# EAGLE design amiga-usb-disk-reader (EAGLE 9.3.0)
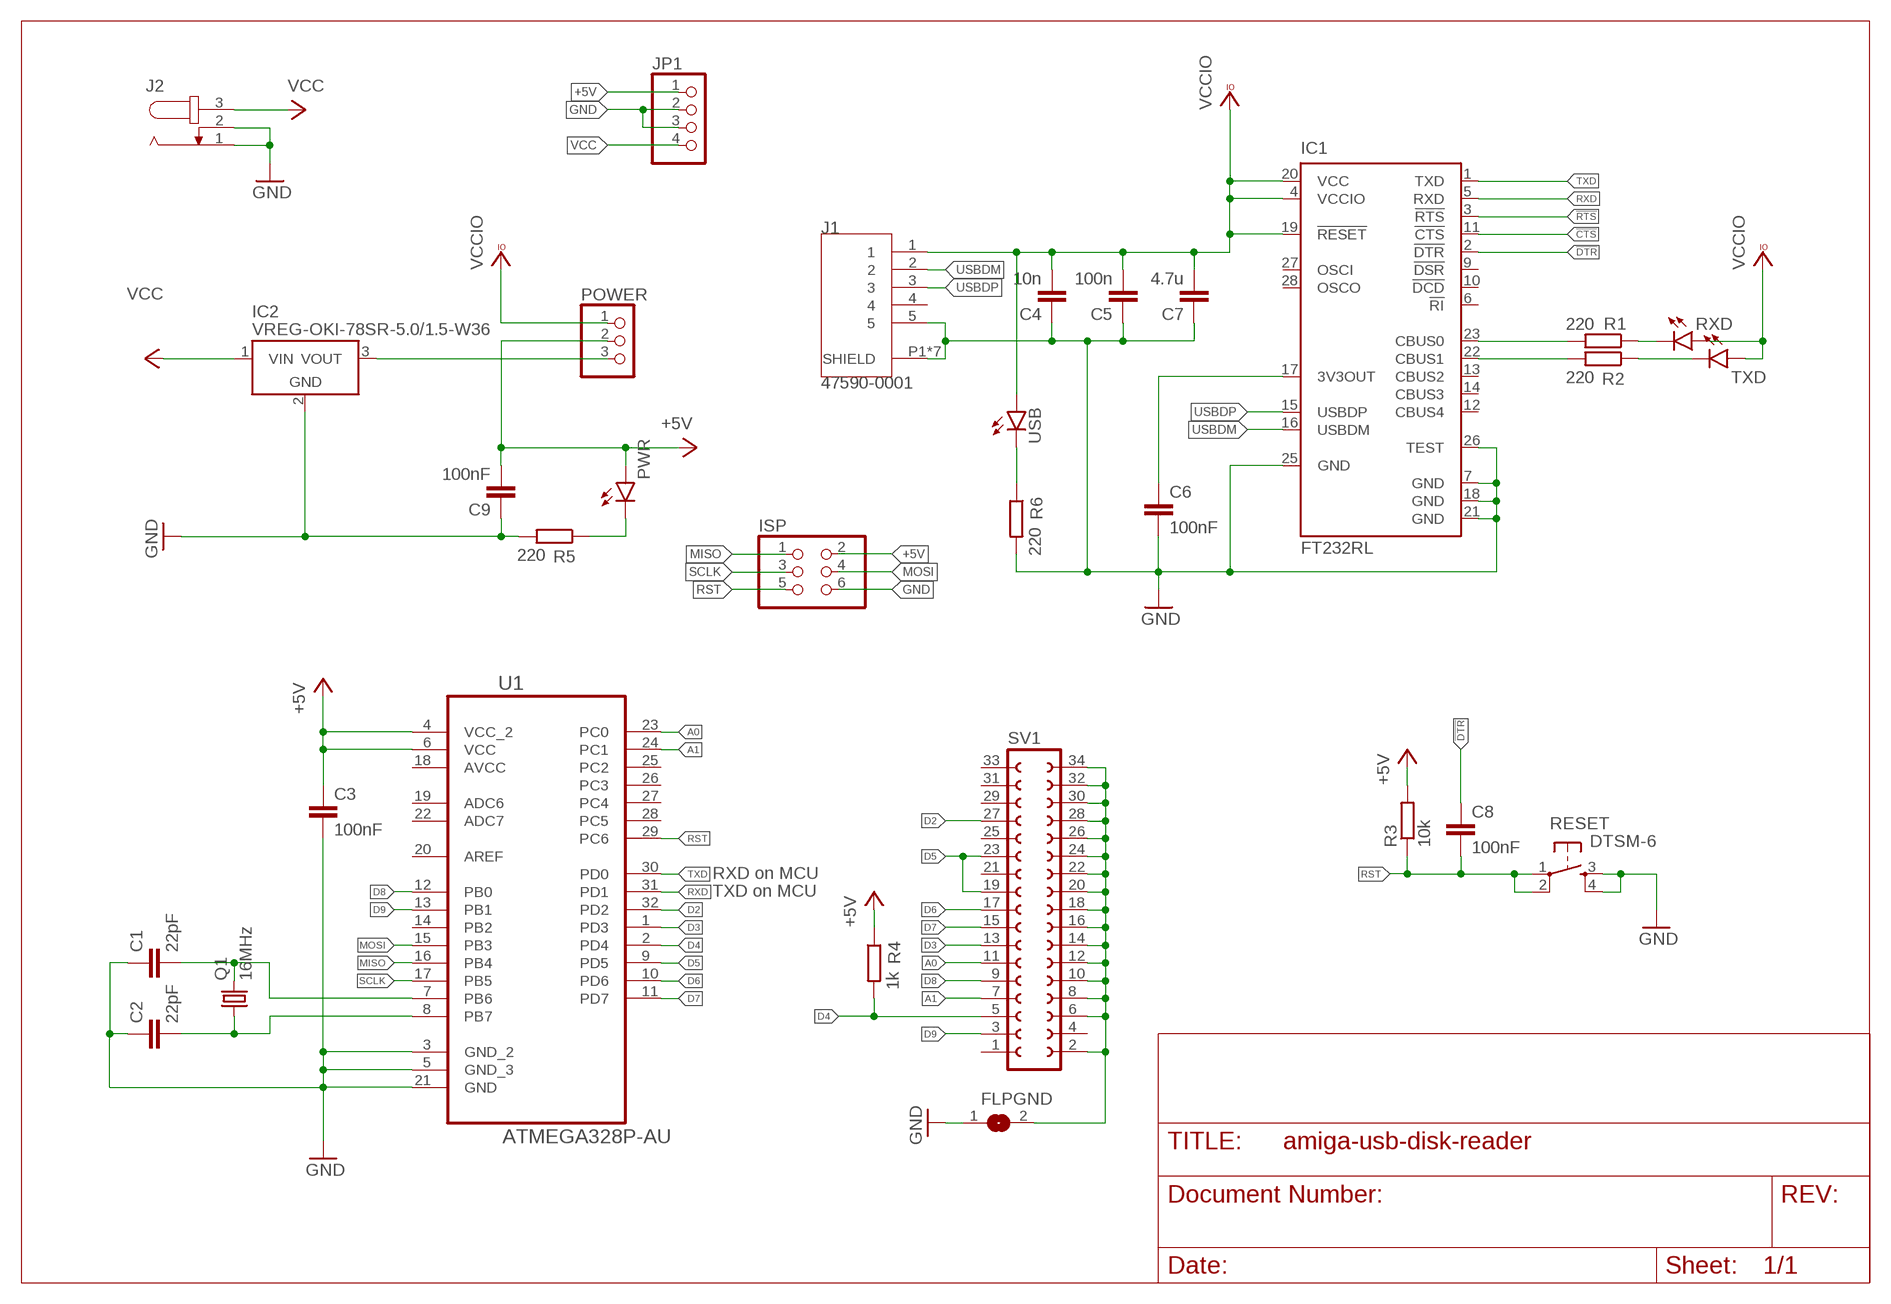
[diagram p0: schematic, sheet 1]

## Parts
C1  22pF  C-EUC0805  [C0805]
C2  22pF  C-EUC0805  [C0805]
C3  100nF  C-EUC0805  [C0805]
C4  10n  C-EUC0805  [C0805]
C5  100n  C-EUC0805  [C0805]
C6  100nF  C-EUC0805  [C0805]
C7  4.7u  C-EUC0805  [C0805]
C8  100nF  C-EUC0805  [C0805]
C9  100nF  C-EUC0805  [C0805]
FLPGND  SJ  [SJ]
IC1  FT232RL  [SSOP28]
IC2  VREG-OKI-78SR-5.0/1.5-W36  [OKI-78SR]
ISP  PINHD-2X3  [2X03]
J1  47590-0001  [MOLEX_47590-0001]
J2  JACK-PLUG0  [SPC4077]
JP1  PINHD-1X4  [1X04]
POWER  PINHD-1X3  [1X03]
PWR  LEDSML0805  [SML0805]
Q1  16MHz  CRYSTALHC49U70  [HC49U70]
R1  220  R-EU_R0805  [R0805]
R2  220  R-EU_R0805  [R0805]
R3  10k  R-EU_R0805  [R0805]
R4  1k  R-EU_R0805  [R0805]
R5  220  R-EU_R0805  [R0805]
R6  220  R-EU_R0805  [R0805]
RESET  DTSM-6  [DTSM-6]
RXD  LEDSML0805  [SML0805]
SV1  FE17-2W  [FE17-2W]
TXD  LEDSML0805  [SML0805]
U1  ATMEGA328P-AU  [QFP80P900X900X120-32N]
USB  LEDSML0805  [SML0805]

## Nets
!CTS: IC1.11(!CTS)
!DTR: C8.1 IC1.2(!DTR)
!RTS: IC1.3(!RTS)
+5V: C3.1 C9.2 ISP.2 JP1.1 POWER.2 PWR.A R3.2 R4.1 U1.4(VCC_2) U1.6(VCC)
A0: SV1.11 U1.23(PC0)
A1: SV1.7 U1.24(PC1)
CBUS0: IC1.23(CBUS0) R1.2
CBUS1: IC1.22(CBUS1) R2.2
D2: SV1.27 U1.32(PD2)
D3: SV1.13 U1.1(PD3)
D4: R4.2 SV1.5 U1.2(PD4)
D5: SV1.19 SV1.23 U1.9(PD5)
D6: SV1.17 U1.10(PD6)
D7: SV1.15 U1.11(PD7)
D8: SV1.9 U1.12(PB0)
D9: SV1.3 U1.13(PB1)
GND: C1.1 C2.1 C3.2 C4.1 C5.1 C6.2 C7.1 C9.1 FLPGND.1 IC1.7(GND) IC1.18(GND) IC1.21(GND) IC1.25(GND) IC1.26(TEST) IC2.2(GND) ISP.6 J1.5 J1.P1(SHIELD) J1.P2(SHIELD) J1.P3(SHIELD) J1.S1(SHIELD) J1.S2(SHIELD) J1.S3(SHIELD) J1.S4(SHIELD) J2.1 J2.2 JP1.2 JP1.3 R5.2 R6.2 RESET.3 RESET.4 U1.3(GND_2) U1.5(GND_3) U1.21(GND)
MISO: ISP.1 U1.16(PB4)
MOSI: ISP.4 U1.15(PB3)
N$1: C6.1 IC1.17(3V3OUT)
N$2: C2.2 Q1.1 U1.8(PB7)
N$3: C1.2 Q1.2 U1.7(PB6)
N$5: FLPGND.2 SV1.2 SV1.6 SV1.8 SV1.10 SV1.12 SV1.14 SV1.16 SV1.18 SV1.20 SV1.22 SV1.24 SV1.26 SV1.28 SV1.30 SV1.32 SV1.34
N$6: R2.1 TXD.C
N$7: R1.1 RXD.C
N$8: U1.29(PC6)
N$9: PWR.C R5.1
N$10: IC2.3(VOUT) POWER.3
N$11: R6.1 USB.C
RST: C8.2 ISP.5 R3.1 RESET.1 RESET.2
RXD: IC1.5(RXD) U1.31(PD1)
SCLK: ISP.3 U1.17(PB5)
TXD: IC1.1(TXD) U1.30(PD0)
USBDM: IC1.16(USBDM) J1.2
USBDP: IC1.15(USBDP) J1.3
VCC: IC2.1(VIN) J2.3 JP1.4
VCCIO: C4.2 C5.2 C7.2 IC1.4(VCCIO) IC1.19(!RESET) IC1.20(VCC) J1.1 POWER.1 RXD.A TXD.A USB.A
Unconnected: IC1.6(!RI) IC1.9(!DSR) IC1.10(!DCD) IC1.12(CBUS4) IC1.13(CBUS2) IC1.14(CBUS3) IC1.27(OSCI) IC1.28(OSCO) J1.4 SV1.1 SV1.4 SV1.21 SV1.25 SV1.29 SV1.31 SV1.33 U1.14(PB2) U1.19(ADC6) U1.20(AREF) U1.22(ADC7) U1.25(PC2) U1.26(PC3) U1.27(PC4) U1.28(PC5)

## Notes on the sheet
- RXD on MCU
- TXD on MCU

## Power pins joined to a net without a drawn wire
AVCC: U1.18(AVCC)

## Library data of the parts
C1-C9 = rcl:C-EU: CAPACITOR, European symbol; SPICEPREFIX: C
FLPGND = jumper:SJ: SMD solder JUMPER
IC1 = ftdichip:FT232R: Source: http://www.ftdichip.com/Documents/DataSheets/DS_FT232R_v104.pdf; MPN: FT232RL; OC_FARNELL: 1146032; OC_NEWARK: 91K9918
IC2 = we-power:VREG: Voltage Regulators (LDOs, Switching Converters...) LDOs Taiwan Semi TS1117 800mA max 15V - compatible On Semi NCP1117 1A max 20V - compatible Diodes AP2111H 0.6A max 6V (0.25V@0.6A) - compatible Diodes AP2114H 1A max 6V (0.45V@1A) Taiwan Semi TS9011 250mA max 12V - compatible Diodes AP2210 300mA max 15V - compatible Microchip MCP1700 250mA max 6.5V - compatible Microchip MCP1702 250mA max 13V - compatible Microchip MCP1703 250mA max 16V - compatible Microchip MCP1754 150mA max 16V Taiwan Semi TS5204 150mA max 16V (low noise) DC/DC Converter Modules Recom R-78Ex.x-1.0-W36 1A max 28V - compatible CUI V78xx-2000 2A max 18V Murata OKI-78SR-x.x/1.5-W36 1.5A max 36V
ISP = pinhead:PINHD-2X3: PIN HEADER
J1 = 47590-0001:47590-0001: 0.65mm (.0256") Pitch Micro-USB AB Receptacle, Right Angle, Bottom Mount, SMT, Lead Free; AVAILABILITY: Good; DESCRIPTION: 0.65mm _.0256_ Pitch Micro-USB AB Receptacle, Right Angle, Bottom Mount, SMT, Lead Free; MF: Molex; MP: 47590-0001; PACKAGE: None; PRICE: 0.52 USD
J2 = con-jack:JACK-PLUG: DC POWER JACK Power Jack, DC, Right Angle, Through Hole, Rated 5A at 16VDC, PC Terminals Distributor: Farnell (www.Farnell.de) Drawing: 84N1161.pdf / 84N1162.pdf Manufacturer: SPC Technology (www.spctechnology.com) Type: SPC4077 / SPC 4078; OC_FARNELL: unknown; OC_NEWARK: unknown
JP1 = pinhead:PINHD-1X4: PIN HEADER
POWER = pinhead:PINHD-1X3: PIN HEADER
PWR RXD TXD USB = led:LED: LED OSRAM: - CHIPLED LG R971, LG N971, LY N971, LG Q971, LY Q971, LO R971, LY R971 LH N974, LH R974 LS Q976, LO Q976, LY Q976 LO Q996 - Hyper CHIPLED LW Q18S LB Q993, LB Q99A, LB R99A - SideLED LS A670, LO A670, LY A670, LG A670, LP A670 LB A673, LV A673, LT A673, LW A673 LH A674 LY A675 LS A676, LA A676, LO A676, LY A676, LW A676 LS A679, LY A679, LG A679 - Hyper Micro SIDELED® LS Y876, LA Y876, LO Y876, LY Y876 LT Y87S - SmartLED LW L88C, LW L88S LB L89C, LB L89S, LG L890 LS L89K, LO L89K, LY L89K LS L896, LA L896, LO L896, LY L896 - TOPLED LS T670, LO T670, LY T670, LG T670, LP T670 LSG T670, LSP T670, LSY T670, LOP T670, LYG T670 LG T671, LOG T671, LSG T671 LB T673, LV T673, LT T673, LW T673 LH T674 LS T676, LA T676, LO T676, LY T676, LB T676, LH T676, LSB T676, LW T676 LB T67C, LV T67C, LT T67C, LS T67K, LO T67K, LY T67K, LW E67C LS E67B, LA E67B, LO E67B, LY E67B, LB E67C, LV E67C, LT E67C LW T67C LS T679, LY T679, LG T679 LS T770, LO T770, LY T770, LG T770, LP T770 LB T773, LV T773, LT T773, LW T773 LH T774 LS E675, LA E675, LY E675, LS T675 LS T776, LA T776, LO T776, LY T776, LB T776 LHGB T686 LT T68C, LB T68C - Hyper Mini TOPLED® LB M676 - Mini TOPLED Santana® LG M470 LS M47K, LO M47K, LY M47K Source: http://www.osram.convergy.de LUXEON: - LUMILED® LXK2-PW12-R00, LXK2-PW12-S00, LXK2-PW14-U00, LXK2-PW14-V00 LXK2-PM12-R00, LXK2-PM12-S00, LXK2-PM14-U00 LXK2-PE12-Q00, LXK2-PE12-R00, LXK2-PE12-S00, LXK2-PE14-T00, LXK2-PE14-U00 LXK2-PB12-K00, LXK2-PB12-L00, LXK2-PB12-M00, LXK2-PB14-N00, LXK2-PB14-P00, LXK2-PB14-Q00 LXK2-PR12-L00, LXK2-PR12-M00, LXK2-PR14-Q00, LXK2-PR14-R00 LXK2-PD12-Q00, LXK2-PD12-R00, LXK2-PD12-S00 LXK2-PH12-R00, LXK2-PH12-S00 LXK2-PL12-P00, LXK2-PL12-Q00, LXK2-PL12-R00 Source: www.luxeon.com KINGBRIGHT: KA-3528ASYC Source: www.kingbright.com
Q1 = adafruit:CRYSTAL: CRYSTAL; OC_FARNELL: unknown; OC_NEWARK: unknown
R1-R6 = rcl:R-EU_: RESISTOR, European symbol; SPICEPREFIX: R
RESET = switch-tact:DTSM-6
SV1 = con-lsta:FE17-2W: FEMALE HEADER; OC_FARNELL: unknown; OC_NEWARK: unknown
U1 = Atmel_By_element14_Batch_1-00:ATMEGA328P-AU: 8-bit Microcontroller with In-System Programmable Flash; MPN: ATMEGA328P-AU; OC_FARNELL: 1715486; OC_NEWARK: 14R4631; PACKAGE: TQFP-32; SUPPLIER: Atmel

## Board
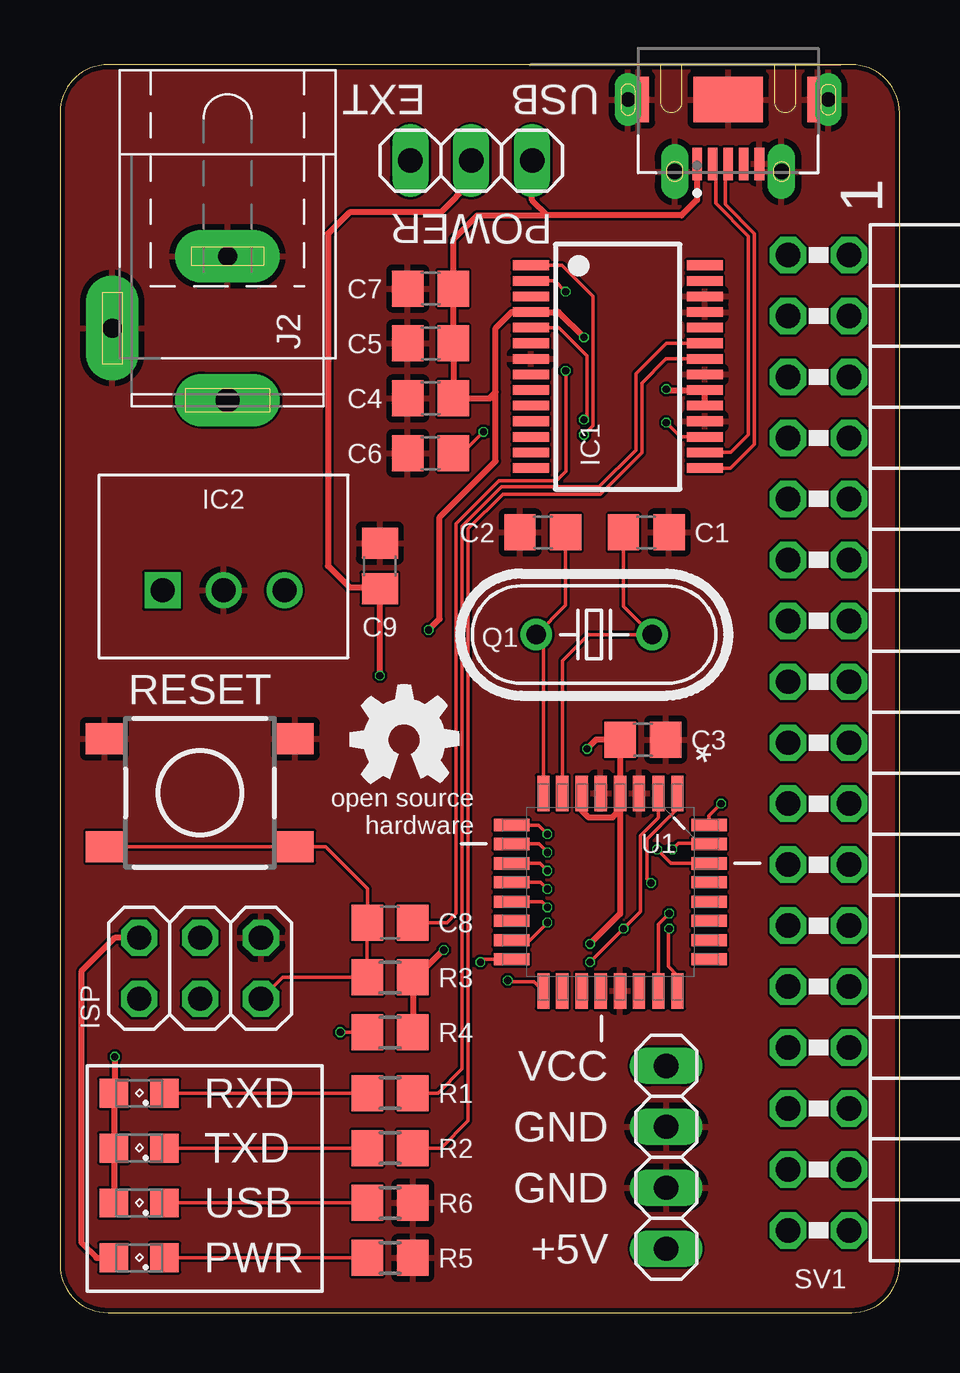
[diagram p1: board, top side]
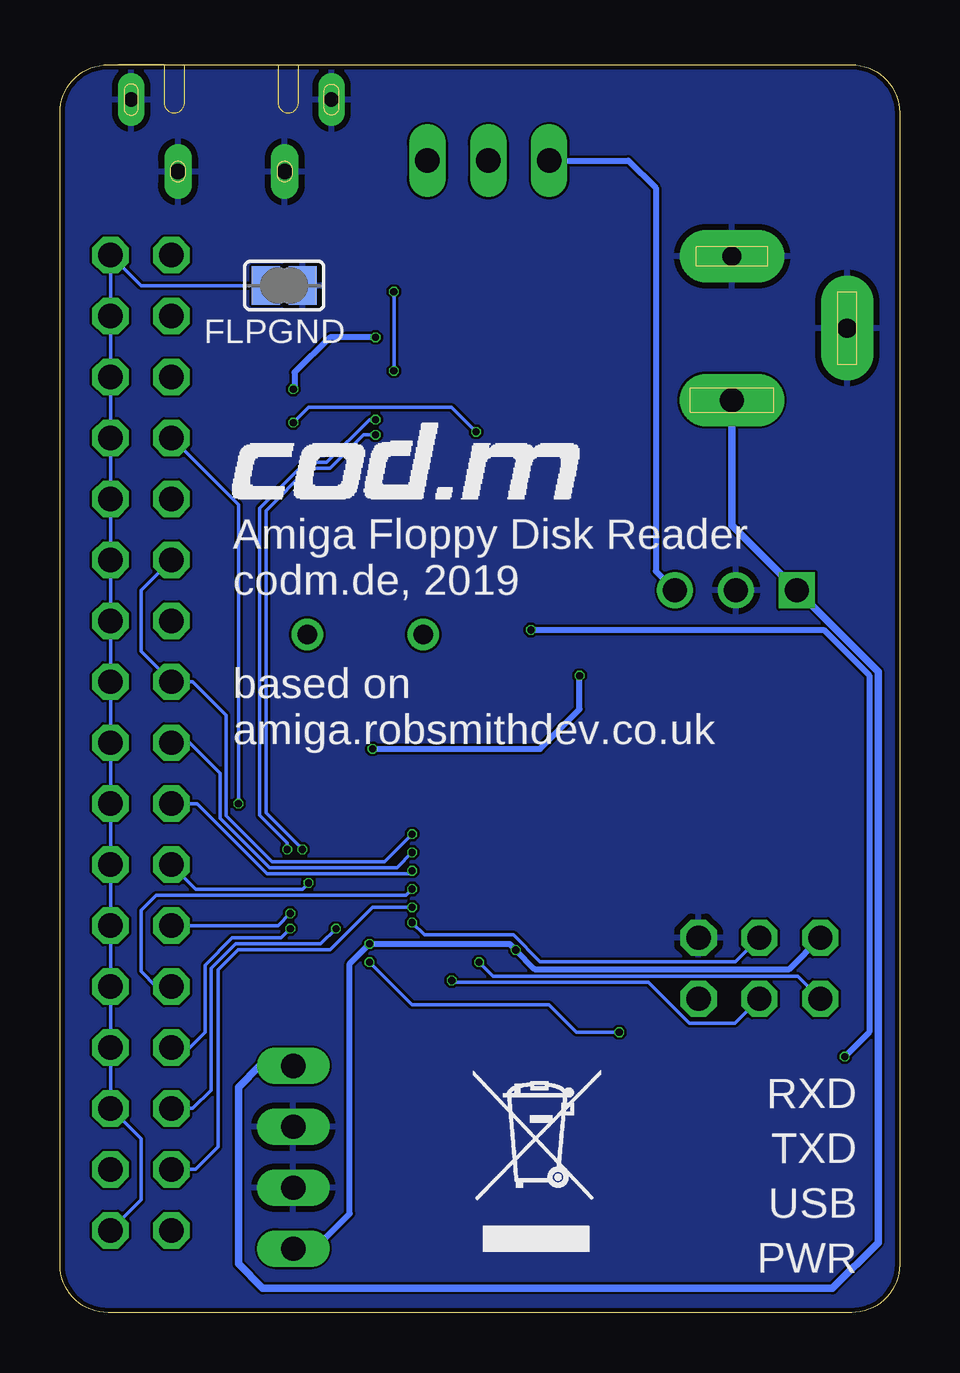
[diagram p2: board, bottom side, seen from below]

Size 35 x 52 mm. Coordinates in mm from the lower left corner, seen from the top.
Outline: 0,2 arc90 2,0 33,0 arc90 35,2 35,50 arc90 33,52 2,52 arc90 0,50 0,2
Copper layers (1*16): Top 0.035mm / dielectric 1.5mm / Bottom 0.035mm
Design rules "aisler_go_2layer": minimum track width 0.1mm, minimum drill 0.2mm, track to track 0.1mm, track to pad 0.1mm, pad to pad 0.1mm, via to via 0.1mm, smd to smd 0.1mm, copper to edge 0.2mm, drill to drill 0.21mm, minimum pad ring 0.25mm, minimum via ring 0.05mm, stop-mask expansion 0.01mm, vias tented up to drill 0mil, thermal gap 10mil

### Footprints (pad centres in the part's own frame; a part is rotated, then mirrored left to right if it is on the bottom)
C0805 = smd 1.3 x 1.5: 1 -0.95,0; 2 0.95,0
SJ = smd 1.168 x 1.6: 1 -0.762,0; 2 0.762,0
SSOP28 = smd 0.4 x 1.5: 1 -4.225,-3.625; 2 -3.575,-3.625; 3 -2.925,-3.625; 4 -2.275,-3.625; 5 -1.625,-3.625; 6 -0.975,-3.625; 7 -0.325,-3.625; 8 0.325,-3.625; 9 0.975,-3.625; 10 1.625,-3.625; 11 2.275,-3.625; 12 2.925,-3.625; 13 3.575,-3.625; 14 4.225,-3.625; 15 4.225,3.625; 16 3.575,3.625; 17 2.925,3.625; 18 2.275,3.625; 19 1.625,3.625; 20 0.975,3.625; 21 0.325,3.625; 22 -0.325,3.625; 23 -0.975,3.625; 24 -1.625,3.625; 25 -2.275,3.625; 26 -2.925,3.625; 27 -3.575,3.625; 28 -4.225,3.625
OKI-78SR = drill 1 pad 1.5 square: 1 -2.54,0 | drill 1 pad 1.5: 2 0,0; 3 2.54,0
2X03 = drill 1.016 octagon: 1 -2.54,-1.27; 2 -2.54,1.27; 3 0,-1.27; 4 0,1.27; 5 2.54,-1.27; 6 2.54,1.27
MOLEX_47590-0001 = smd 0.4 x 1.35: 1 1.3,2.675; 2 0.65,2.675; 3 0,2.675; 4 -0.65,2.675; 5 -1.3,2.675 | smd 2.9 x 1.9: P1 0,0 | smd 0.875 x 1.9: P2 -3.737,0; P3 3.737,0 | drill 0.65 pad 1.05 long: S1 -2.225,3; S2 2.225,3 | drill 0.6 pad 0.95 long: S3 -4.175,0; S4 4.175,0
SPC4077 = drill 0.8 pad 2.184 long: 1 -3,0; 2 0,-4.8 | drill 1 pad 2.184 long: 3 3,0
1X04 = drill 1.016 long: 1 -3.81,0; 2 -1.27,0; 3 1.27,0; 4 3.81,0
1X03 = drill 1.016 long: 1 -2.54,0; 2 0,0; 3 2.54,0
SML0805 = smd 1.2 x 1.2: A 1.05,0; C -1.05,0
HC49U70 = drill 0.813: 1 -2.413,0; 2 2.413,0
R0805 = smd 1.3 x 1.5: 1 -0.95,0; 2 0.95,0
DTSM-6 = smd 1.55 x 1.3: 1 -3.975,2.25; 2 3.975,2.25; 3 -3.975,-2.25; 4 3.975,-2.25
FE17-2W = drill 1.016 octagon: 1 -20.32,1.27; 2 -20.32,-1.27; 3 -17.78,1.27; 4 -17.78,-1.27; 5 -15.24,1.27; 6 -15.24,-1.27; 7 -12.7,1.27; 8 -12.7,-1.27; 9 -10.16,1.27; 10 -10.16,-1.27; 11 -7.62,1.27; 12 -7.62,-1.27; 13 -5.08,1.27; 14 -5.08,-1.27; 15 -2.54,1.27; 16 -2.54,-1.27; 17 0,1.27; 18 0,-1.27; 19 2.54,1.27; 20 2.54,-1.27; 21 5.08,1.27; 22 5.08,-1.27; 23 7.62,1.27; 24 7.62,-1.27; 25 10.16,1.27; 26 10.16,-1.27; 27 12.7,1.27; 28 12.7,-1.27; 29 15.24,1.27; 30 15.24,-1.27; 31 17.78,1.27; 32 17.78,-1.27; 33 20.32,1.27; 34 20.32,-1.27
QFP80P900X900X120-32N = smd 1.473 x 0.508: 1 -4.115,2.794; 2 -4.115,2.007; 3 -4.115,1.194; 4 -4.115,0.406; 5 -4.115,-0.406; 6 -4.115,-1.194; 7 -4.115,-2.007; 8 -4.115,-2.794; 17 4.115,-2.794; 18 4.115,-2.007; 19 4.115,-1.194; 20 4.115,-0.406; 21 4.115,0.406; 22 4.115,1.194; 23 4.115,2.007; 24 4.115,2.794 | smd 0.508 x 1.473: 9 -2.794,-4.115; 10 -2.007,-4.115; 11 -1.194,-4.115; 12 -0.406,-4.115; 13 0.406,-4.115; 14 1.194,-4.115; 15 2.007,-4.115; 16 2.794,-4.115; 25 2.794,4.115; 26 2.007,4.115; 27 1.194,4.115; 28 0.406,4.115; 29 -0.406,4.115; 30 -1.194,4.115; 31 -2.007,4.115; 32 -2.794,4.115

### Placement (x,y rotation side)
C1  24.44,32.51 180 top
C2  20.13,32.51 0 top
C3  24.3,23.88 0 top
C4  15.45,38.1 0 top
C5  15.45,40.39 0 top
C6  15.45,35.81 180 top
C7  15.45,42.67 0 top
C8  13.76,16.26 180 top
C9  13.34,31.11 270 top
FLPGND  25.65,42.8 180 bottom
IC1  23.25,39.42 270 top
IC2  6.82,30.1 0 top
ISP  5.84,14.35 0 top
J1  27.86,50.55 180 top
J2  6.99,41.02 270 top
JP1  25.27,6.48 90 top
POWER  17.14,48.01 180 top
PWR  3.3,2.29 180 top
Q1  22.27,28.25 0 top
R1  13.76,9.15 0 top
R2  13.76,6.86 0 top
R3  13.76,13.97 0 top
R4  13.76,11.68 180 top
R5  13.76,2.29 0 top
R6  13.76,4.57 0 top
RESET  5.83,21.66 180 top
RXD  3.3,9.14 180 top
SV1  31.62,23.75 90 top
TXD  3.3,6.86 180 top
U1  22.95,17.53 270 top
U$1  [OSHW_5MM]  14.35,23.88 0 top
U$2  [WEEE-LOGO-5MM]  17.78,2.54 0 bottom
U$3  [CODM-LOGO]  27.8,33.91 0 bottom
USB  3.3,4.57 180 top

### Tracks (layer width: path | path; a pad name or v marks a point on that pad's centre or on a via)
!DTR  (via drill 0.3)
  Top 0.152: C8.1 16.13,16.26 16.51,16.64 16.51,32.87 18.31,34.67 20.7,34.67 21.09,35.06 v21.09,39.24 v21.08,39.24 | v21.08,42.55 20.63,42.99 IC1.2
  Bottom 0.152: v21.08,39.24 v21.08,42.55
+5V  (via drill 0.3)
  Top 0.254: POWER.2 17.14,47.12 15.88,45.85 12.06,45.85 11.18,44.96 11.18,31.11 12.06,30.23 13.14,30.23 13.27,30.1 | C3.1 U1.4 23.35,20.95 | U1.6 21.75,20.92 22.04,20.64 23.03,20.64 23.35,20.95 | C3.1 22.35,23.88 v21.97,23.5 | v16,15.11 15.98,15.11 14.84,13.97 R3.2 R4.1 | 23.35,20.95 23.35,16.62 v22.1,15.37 | ISP.2 2.29,15.62 0.89,14.22 0.89,2.92 1.52,2.29 PWR.A | v13.34,26.54 C9.2
  Top 0.305: 13.27,30.1 C9.2 | C3.1
  Bottom 0.254: v21.97,23.5 14.99,23.5 13.34,25.15 v13.34,26.54 | JP1.1 24.38,2.67 22.92,4.13 22.92,14.54 v22.1,15.37 16.26,15.37 v16,15.11 15.21,14.32 4.6,14.32 ISP.2
A0  (via drill 0.3)
  Top 0.152: U1.23 24.95,16.19 v25.4,16.64
  Bottom 0.152: v25.4,16.64 25.91,16.13 SV1.11
A1  (via drill 0.3)
  Top 0.152: U1.24 25.74,14.05 25.36,14.43 25.36,15.96 v25.4,16
  Bottom 0.152: v25.4,16 25.78,15.62 27.81,15.62 28.96,14.48 28.96,11.68 29.59,11.05 SV1.7
CBUS0
  Top 0.152: R1.2 15.75,9.15 16.76,10.16 16.76,32.76 18.41,34.42 22.48,34.42 24,35.94 24,39.12 25.28,40.39 IC1.23
CBUS1
  Top 0.152: R2.2 15.88,6.86 17.02,8 17.02,32.66 18.47,34.11 22.53,34.11 24.25,35.84 24.25,38.73 25.27,39.74 IC1.22
D2  (via drill 0.3)
  Top 0.152: v27.56,21.21 v27.56,21.2 27.06,20.7 U1.32
  Bottom 0.152: v27.56,21.21 27.56,33.66 SV1.27
D3  (via drill 0.3)
  Top 0.152: U1.1 25.74,21.01 24.47,19.74 24.47,18.08 v24.64,17.91
  Bottom 0.152: v24.64,17.91 24.89,17.65 29.34,17.65 SV1.13
D4  (via drill 0.3)
  Top 0.152: U1.2 24.95,20.62 24.19,19.86 24.19,16.7 v23.5,16 v22.1,14.61 | v11.68,11.68 R4.2
  Bottom 0.152: v23.5,16 24.13,15.37 27.69,15.37 28.7,14.35 28.7,9.27 29.46,8.51 SV1.5 | v22.1,14.61 20.32,12.83 14.61,12.83 13.46,11.68 v11.68,11.68
D5  (via drill 0.3)
  Top 0.152: U1.9 19.94,20.32 v20.32,19.94
  Bottom 0.152: v20.32,19.94 21.46,18.8 26.16,18.8 28.07,20.7 28.07,24.89 29.46,26.29 SV1.19 31.62,27.56 31.62,30.1 SV1.23
D6  (via drill 0.3)
  Top 0.152: U1.10 19.96,19.53 v20.32,19.18
  Bottom 0.152: v20.32,19.18 20.95,18.54 26.27,18.54 28.32,20.6 28.32,22.48 29.59,23.75 SV1.17
D7  (via drill 0.3)
  Top 0.152: U1.11 20.02,18.72 v20.32,18.41
  Bottom 0.152: v20.32,18.41 20.44,18.29 26.37,18.29 29.29,21.21 SV1.15
D8  (via drill 0.3)
  Top 0.152: U1.12 20.04,17.93 v20.32,17.65
  Bottom 0.152: v20.32,17.65 20.57,17.4 30.99,17.4 31.62,16.76 31.62,14.22 30.99,13.59 SV1.9
D9  (via drill 0.3)
  Top 0.152: U1.13 20.09,17.12 v20.32,16.89
  Bottom 0.152: v20.32,16.89 21.97,16.89 23.75,15.11 27.58,15.11 28.4,14.3 28.4,6.91 29.34,5.97 SV1.3
GND
  pour Top: 0,0 0,52.07 35.56,52.07 35.56,0
  pour Bottom: 0,0 0,52.07 34.92,52.07 34.92,0
MISO  (via drill 0.3)
  Top 0.152: U1.16 17.65,14.73 v17.53,14.61
  Bottom 0.152: v17.53,14.61 16.94,14.02 4.24,14.02 ISP.1
MOSI  (via drill 0.3)
  Top 0.152: U1.15 19.58,15.52 v20.32,16.26
  Bottom 0.152: v20.32,16.26 19.81,15.74 16.1,15.74 14.98,14.62 6.84,14.62 ISP.4
N$1  (via drill 0.3)
  Top 0.152: v17.65,36.7 16.76,35.81 C6.1 | IC1.17 25.86,36.49 v25.27,37.08
  Bottom 0.152: v25.27,37.08 24.64,37.72 18.67,37.72 v17.65,36.7
N$2
  Top 0.152: C2.2 21.08,29.48 Q1.1 20.15,27.96 U1.8
N$3
  Top 0.152: C1.2 23.49,29.44 Q1.2 22.03,28.25 20.94,27.16 U1.7
N$5
  Bottom 0.152: SV1.2 31.62,4.7 31.62,7.24 SV1.6 SV1.8 SV1.10 SV1.12 SV1.14 SV1.16 SV1.18 SV1.20 SV1.22 SV1.24 SV1.26 SV1.28 SV1.30 SV1.32 SV1.34 31.62,42.8 FLPGND.2
N$6
  Top 0.152: TXD.C R2.1
N$7
  Top 0.152: RXD.C R1.1
N$9
  Top 0.152: PWR.C R5.1
N$10
  Bottom 0.254: POWER.3 11.3,48.01 10.16,46.86 10.16,30.9 IC2.3
N$11
  Top 0.152: USB.C R6.1
RST
  Top 0.152: RESET.2 RESET.1 11.08,19.41 12.83,17.66 12.83,16.27 C8.2 R3.1 9.27,13.97 ISP.5
RXD  (via drill 0.3)
  Top 0.152: v25.53,19.3 25.78,19.56 27.03,19.56 U1.31 | IC1.5 20.81,41.04 21.97,39.88 21.97,37.34 v21.84,37.21
  Bottom 0.152: v25.53,19.3 25.53,19.58 26.67,20.72 26.67,33.53 24.76,35.43 23.88,35.43 22.1,37.21 v21.84,37.21
SCLK  (via drill 0.3)
  Top 0.152: v18.67,13.84 18.72,13.79 19.77,13.79 U1.17
  Bottom 0.152: ISP.3 6.86,12.06 8.76,12.06 10.46,13.76 18.59,13.76 v18.67,13.84
TXD  (via drill 0.3)
  Top 0.152: v24.89,19.3 25.48,18.72 U1.30 | IC1.1 20.94,43.64 22.23,42.35 22.23,36.96 v21.84,36.58
  Bottom 0.152: v24.89,19.3 26.42,20.83 26.42,33.42 24.66,35.18 23.75,35.18 22.35,36.58 v21.84,36.58
USBDM
  Top 0.152: IC1.16 27.97,35.84 28.7,36.58 28.7,44.85 27.34,46.22 27.34,47.74 J1.2
USBDP
  Top 0.152: IC1.15 27.95,35.19 28.96,36.2 28.96,44.96 27.73,46.18 27.73,47.74 J1.3
VCC
  Bottom 0.305: J2.3 6.99,32.81 IC2.1 0.89,26.71 0.89,2.92 2.79,1.02 26.54,1.02 27.56,2.03 27.56,9.4 26.67,10.29 JP1.4
VCCIO  (via drill 0.3)
  Top 0.254: J1.1 26.56,46.37 25.91,45.72 20.32,45.72 | 20.32,45.72 19.68,46.35 POWER.1 | 20.32,45.72 17.4,45.72 16.4,44.72 C7.2 C5.2 | 16.44,40.42 C5.2 | C5.2 C4.2 17.91,38.1 18.16,38.35 | 18.16,38.35 18.16,41.02 18.83,41.69 IC1.4 | 19.59,41.66 IC1.4 | IC1.4 20.79,41.69 v21.84,40.64 | IC1.19 IC1.20 25.31,38.44 v25.27,38.48 | v15.37,28.45 15.82,28.91 15.82,33.14 18.16,35.48 18.16,38.35 | v2.29,10.67 2.29,9.18 RXD.A TXD.A USB.A
  Bottom 0.254: 21.97,40.64 v21.84,40.64 23.75,40.64 25.21,39.18 | v15.37,28.45 3.16,28.45 1.27,26.55 1.27,11.69 v2.29,10.67 | 25.21,39.18 25.22,39.17 | 25.21,39.18 25.21,38.54 v25.27,38.48

### Text on the board
tNames: EXT | USB | 1 | VCC | GND | GND | +5V
bNames: Amiga Floppy Disk Reader / codm.de, 2019 | based on / amiga.robsmithdev.co.uk | RXD | TXD | USB | PWR